# EAGLE design DisplayAddOn_V004 (EAGLE 9.0.1)
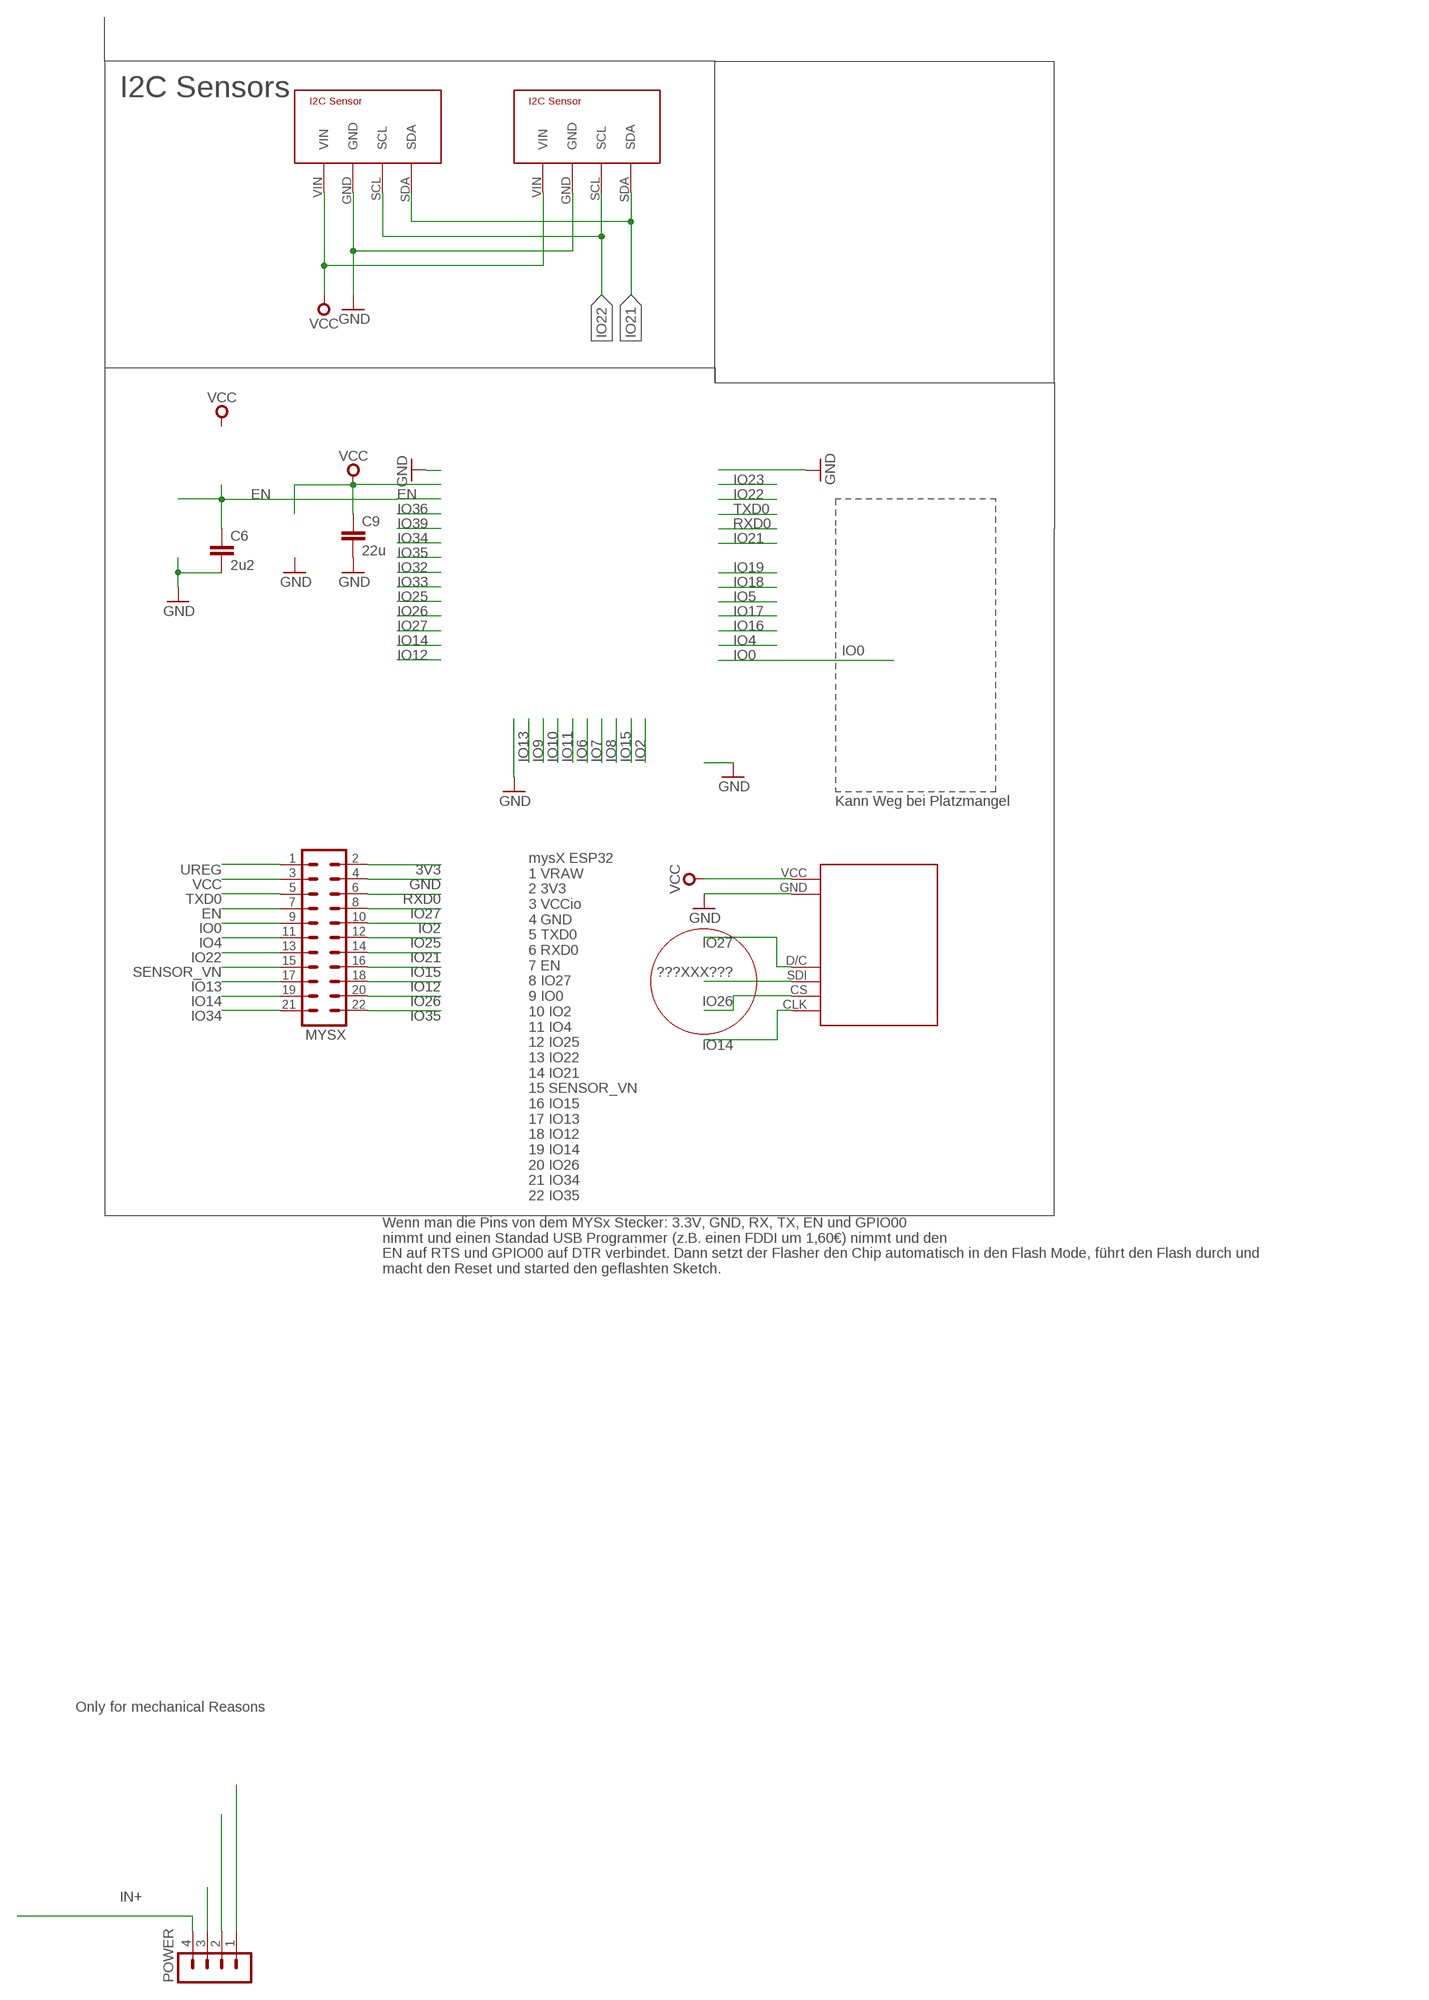
[diagram p0: schematic, sheet 1]

## Parts
C6  2u2  C-EUC0805  [C0805]
C9  22u  C-EUC0805  [C0805]
MYSX  MA11-2  [MA11-2]
POWER  MA04-1  [MA04-1]
U$1  HELTEC_1.54STANDARD1  [HELTEC_1.54INCH]
U$2  I2C-BREAKOUT  [I2C_BREAKOUT]
U$4  I2C-BREAKOUT  [I2C_BREAKOUT]

## Nets
3V3: MYSX.2
???XXX???: U$1.SDI
B+ [vcc]: POWER.1
B- [gnd]: POWER.2
EN: C6.1 MYSX.7
GND [gnd]: C6.2 C9.2 MYSX.4 U$1.GND U$2.GND U$4.GND
IN+ [vcc]: POWER.4
IO0: MYSX.9
IO2: MYSX.10
IO4: MYSX.11
IO12: MYSX.18
IO13: MYSX.17
IO14: MYSX.19 U$1.CLK
IO15: MYSX.16
IO21: MYSX.14 U$2.SDA U$4.SDA
IO22: MYSX.13 U$2.SCL U$4.SCL
IO25: MYSX.12
IO26: MYSX.20 U$1.CS
IO27: MYSX.8 U$1.D/C
IO34: MYSX.21
IO35: MYSX.22
N$2 [gnd]: POWER.3
RXD0: MYSX.6
SENSOR_VN: MYSX.15
TXD0: MYSX.5
UREG [gnd]: MYSX.1
VCC [gnd]: C9.1 MYSX.3 U$1.VCC U$2.VIN U$4.VIN

## Notes on the sheet
- I2C Sensors
- Kann Weg bei Platzmangel
- mysX ESP32
  1 VRAW
  2 3V3
  3 VCCio
  4 GND
  5 TXD0
  6 RXD0
  7 EN
  8 IO27
  9 IO0
  10 IO2
  11 IO4
  12 IO25
  13 IO22
  14 IO21
  15 SENSOR_VN
  16 IO15
  17 IO13
  18 IO12
  19 IO14
  20 IO26
  21 IO34
  22 IO35
- Wenn man die Pins von dem MYSx Stecker: 3.3V, GND, RX, TX, EN und GPIO00
  nimmt und einen Standad USB Programmer (z.B. einen FDDI um 1,60€) nimmt und den
  EN auf RTS und GPIO00 auf DTR verbindet. Dann setzt der Flasher den Chip automatisch in den Flash Mode, führt den Flash durch und
  macht den Reset und started den geflashten Sketch.
- Only for mechanical Reasons

## Library data of the parts
C6 C9 = rcl@1:C-EU: CAPACITOR, European symbol; SPICEPREFIX: C
MYSX = con-Pinheader:MA11-2: PIN HEADER; OC_FARNELL: unknown; OC_NEWARK: unknown
POWER = con-lstb:MA04-1: PIN HEADER; OC_FARNELL: unknown; OC_NEWARK: unknown
U$1 = display:HELTEC_1.54
U$2 U$4 = i2c:I2C-BREAKOUT

## Net classes
0 default: width 0.305 mm, clearance 0.205 mm
1 gnd: width 0.559 mm, drill 0.635 mm, clearance 0.254 mm
2 vcc: width 0.61 mm, drill 0.406 mm, clearance 0.254 mm

## Board
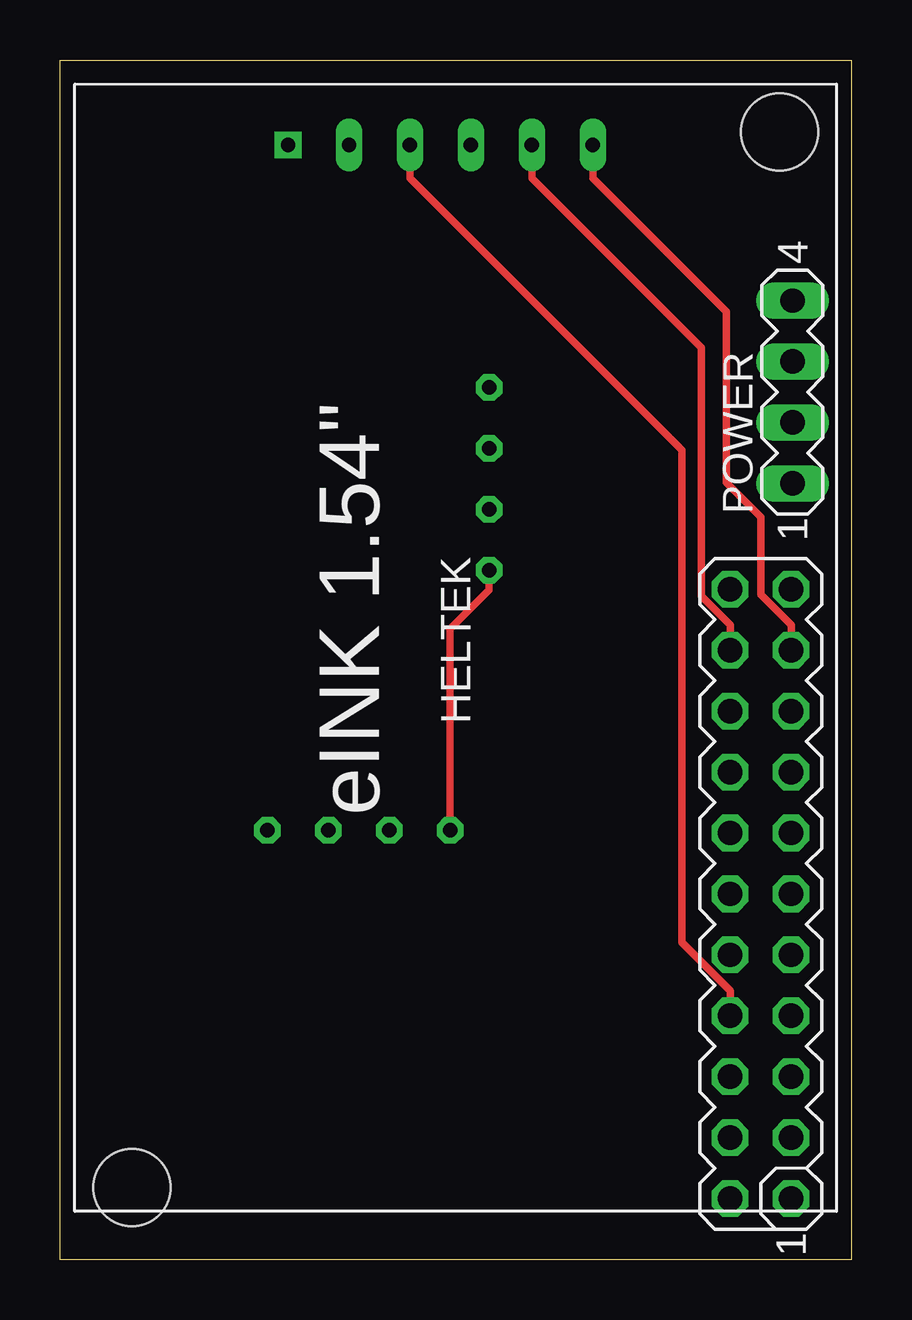
[diagram p1: board, top side]
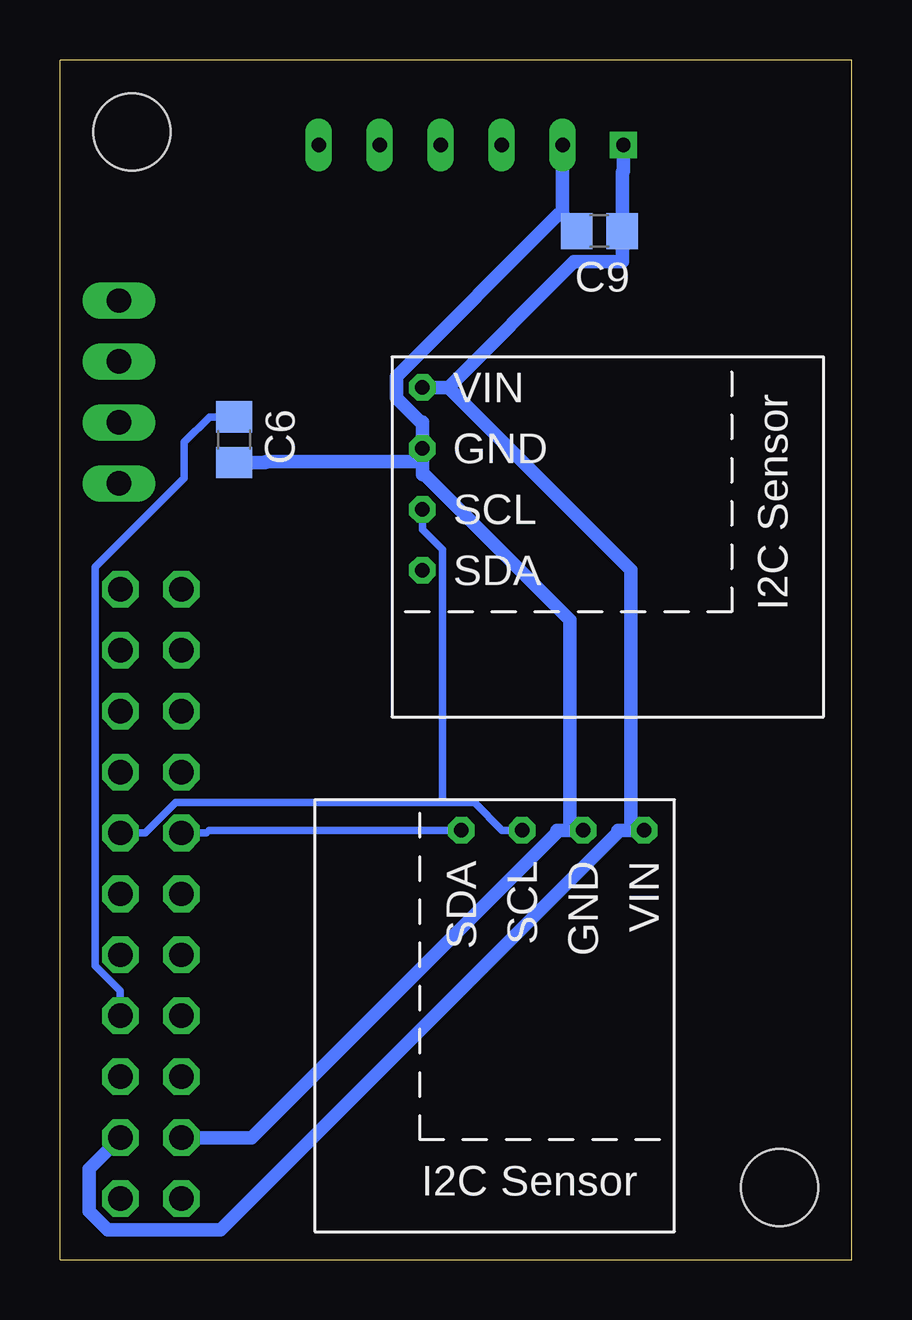
[diagram p2: board, bottom side, seen from below]

Size 33 x 50 mm. Coordinates in mm from the lower left corner, seen from the top.
Outline: 0,0 0,50 33,50 33,0 0,0
Copper layers (1*16): Top 0.035mm / dielectric 1.5mm / Bottom 0.035mm
Design rules "dirt_cheap_dirty_boards.v1": minimum track width 5mil, minimum drill 12mil, track to track 5mil, track to pad 5mil, pad to pad 5mil, via to via 5mil, smd to smd 0mil, copper to edge 10mil, drill to drill 10mil, minimum pad ring 10mil, minimum via ring 6mil, stop-mask expansion 2mil, vias tented up to drill 25mil, thermal gap 10mil
Holes 3.2 mm at 3,3 30,47

### Footprints (pad centres in the part's own frame; a part is rotated, then mirrored left to right if it is on the bottom)
C0805 = smd 1.3 x 1.5: 1 -0.95,0; 2 0.95,0
MA11-2 = drill 1.016 octagon: 1 -12.7,-1.27; 2 -12.7,1.27; 3 -10.16,-1.27; 4 -10.16,1.27; 5 -7.62,-1.27; 6 -7.62,1.27; 7 -5.08,-1.27; 8 -5.08,1.27; 9 -2.54,-1.27; 10 -2.54,1.27; 11 0,-1.27; 12 0,1.27; 13 2.54,-1.27; 14 2.54,1.27; 15 5.08,-1.27; 16 5.08,1.27; 17 7.62,-1.27; 18 7.62,1.27; 19 10.16,-1.27; 20 10.16,1.27; 21 12.7,-1.27; 22 12.7,1.27
MA04-1 = drill 1.016 long: 1 -3.81,0; 2 -1.27,0; 3 1.27,0; 4 3.81,0
HELTEC_1.54INCH = drill 0.6 long: CLK 21.59,-7.62; CS 21.59,-5.08; D/C 21.59,0; GND 21.59,2.54; SDI 21.59,-2.54 | drill 0.6 square: VCC 21.59,5.08
I2C_BREAKOUT = drill 0.6 octagon: GND -3.81,-8.89; SCL -1.27,-8.89; SDA 1.27,-8.89; VIN -6.35,-8.89

### Placement (x,y rotation side)
C6  25.74,34.17 270 bottom
C9  10.51,42.87 180 bottom
MYSX  29.21,15.24 90 top
POWER  30.54,36.16 90 top
U$1  14.59,24.87 90 top
U$2  9,30 270 bottom
U$4  15,9 180 bottom

### Tracks (layer width: path | path; a pad name or v marks a point on that pad's centre or on a via)
EN
  Bottom 0.305: C6.1 26.77,35.12 27.81,34.08 27.81,32.57 31.52,28.86 31.52,12.24 30.48,11.2 MYSX.7
GND
  Bottom 0.559: 12.05,43.55 12.23,43.55 18.98,36.8 18.98,35.9 17.98,34.9 17.89,34.9 U$2.GND 17.89,33.27 | C9.2 11.46,42.96 12.05,43.55 | 12.05,43.55 12.05,44.82 U$1.GND | C6.2 24.46,33.23 24.41,33.27 17.89,33.27 | 17.89,33.27 17.89,32.72 17.8,32.72 11.73,26.65 11.73,17.89 | 11.73,17.89 12.28,17.89 12.28,17.8 25,5.08 MYSX.4 | U$4.GND 11.73,17.89
IO14
  Top 0.305: MYSX.19 30.48,26.44 29.21,27.71 29.21,30.95 27.78,32.39 27.78,39.51 22.21,45.07 U$1.CLK
IO21
  Top 0.305: U$2.SDA 17.89,27.9 16.27,26.28 U$4.SDA
  Bottom 0.305: MYSX.14 26.9,17.78 26.79,17.89 U$4.SDA
IO22
  Bottom 0.305: U$4.SCL 14.56,17.89 15.72,19.05 17.05,19.05 | 17.05,19.05 28.17,19.05 29.44,17.78 MYSX.13 | 17.05,19.05 17.05,29.6 17.89,30.44 U$2.SCL
IO26
  Top 0.305: 26.73,27.65 26.73,38.01 19.67,45.07 U$1.CS | 26.73,27.65 | 26.73,27.65 27.94,26.44 MYSX.20
IO27
  Top 0.305: MYSX.8 27.94,11.2 25.93,13.21 25.93,33.73 14.59,45.07 U$1.D/C
VCC
  Bottom 0.559: 16.8,36.35 9.19,28.74 9.19,17.89 | 9.19,17.89 9.74,17.89 9.74,17.8 26.3,1.24 31.02,1.24 31.78,2 31.78,3.78 MYSX.3 | U$4.VIN 9.19,17.89 | U$2.VIN 16.8,36.35 | 16.8,36.35 11.57,41.59 9.56,41.59 C9.1 9.56,45.32 9.51,45.37 U$1.VCC

### Text on the board
tNames: VCC | GND | SDL | SDA | 5V | UREG | GND | 5V | easyGW BluePill 0.2 / RS485, RFM69, RFM95
bNames: PluepillGW V01 / RS485, RFM69, RFM95
Document: DS_1551K